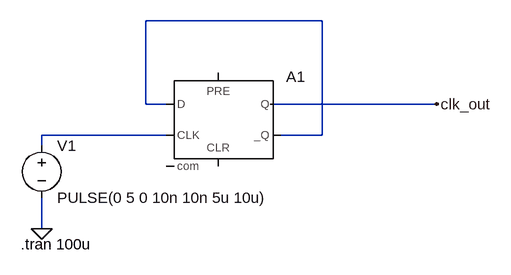
[diagram p0: schematic clk_dev.asc]
clk_dev.asc, the LTspice schematic file:
Version 4
SHEET 1 880 680
WIRE 384 32 112 32
WIRE 112 160 112 32
WIRE 144 160 112 160
WIRE 560 160 304 160
WIRE 144 208 -48 208
WIRE 384 208 384 32
WIRE 384 208 320 208
WIRE -48 224 -48 208
WIRE -48 352 -48 304
FLAG -48 352 0
FLAG 560 160 clk_out
SYMBOL Digital\\dflop 224 112 R0
SYMATTR InstName A1
SYMBOL voltage -48 208 R0
WINDOW 123 0 0 Left 0
WINDOW 39 0 0 Left 0
SYMATTR InstName V1
SYMATTR Value PULSE(0 5 0 10n 10n 5u 10u)
TEXT -80 376 Left 2 !.tran 100u

The netlist it stands for:
* clk_dev.asc
A1 N001 0 N002 0 0 N001 clk_out 0 DFLOP
V1 N002 0 PULSE(0 5 0 10n 10n 5u 10u)
.tran 100u
.backanno
.end